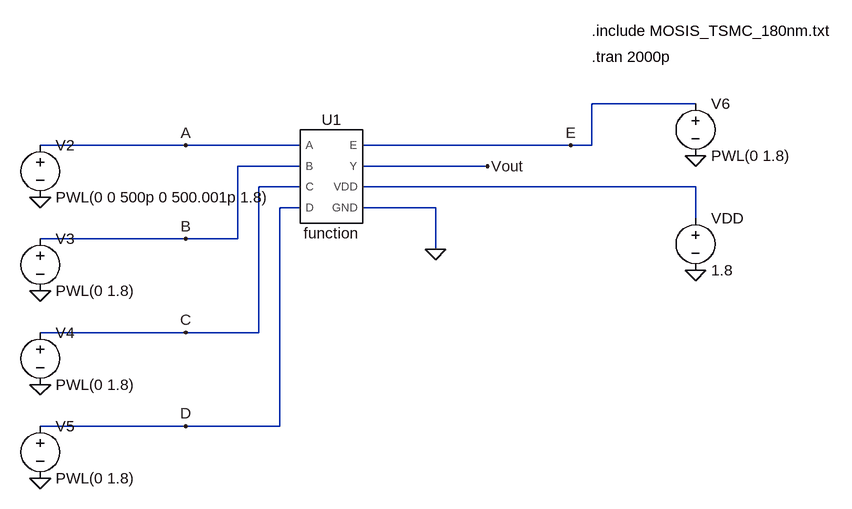
[diagram p0: schematic function.asc]
function.asc, the LTspice schematic file:
Version 4.1
SHEET 1 1000 964
WIRE 768 128 608 128
WIRE -16 192 -240 192
WIRE 160 192 -16 192
WIRE 576 192 256 192
WIRE 608 192 608 128
WIRE 608 192 576 192
WIRE 160 224 64 224
WIRE 448 224 256 224
WIRE 160 256 96 256
WIRE 768 256 256 256
WIRE 160 288 128 288
WIRE 368 288 256 288
WIRE 768 304 768 256
WIRE -16 336 -240 336
WIRE 64 336 64 224
WIRE 64 336 -16 336
WIRE 368 352 368 288
WIRE -16 480 -240 480
WIRE 96 480 96 256
WIRE 96 480 -16 480
WIRE -16 624 -240 624
WIRE 128 624 128 288
WIRE 128 624 -16 624
FLAG -240 560 0
FLAG -240 272 0
FLAG -240 416 0
FLAG 448 224 Vout
FLAG 768 208 0
FLAG 768 384 0
FLAG 368 352 0
FLAG -240 704 0
FLAG -16 192 A
FLAG -16 336 B
FLAG -16 480 C
FLAG -16 624 D
FLAG 576 192 E
SYMBOL voltage -240 176 R0
WINDOW 123 0 0 Left 0
WINDOW 39 0 0 Left 0
SYMATTR InstName V2
SYMATTR Value PWL(0 0 500p 0 500.001p 1.8)
SYMBOL voltage -240 320 R0
WINDOW 123 0 0 Left 0
WINDOW 39 0 0 Left 0
SYMATTR InstName V3
SYMATTR Value PWL(0 1.8)
SYMBOL voltage -240 464 R0
WINDOW 123 0 0 Left 0
WINDOW 39 0 0 Left 0
SYMATTR InstName V4
SYMATTR Value PWL(0 1.8)
SYMBOL function 208 240 R0
SYMATTR InstName U1
SYMBOL voltage 768 288 R0
SYMATTR InstName VDD
SYMATTR Value 1.8
SYMBOL voltage -240 608 R0
WINDOW 123 0 0 Left 0
WINDOW 39 0 0 Left 0
SYMATTR InstName V5
SYMATTR Value PWL(0 1.8)
SYMBOL voltage 768 112 R0
WINDOW 123 0 0 Left 0
WINDOW 39 0 0 Left 0
SYMATTR InstName V6
SYMATTR Value PWL(0 1.8)
TEXT 608 16 Left 2 !.include MOSIS_TSMC_180nm.txt
TEXT 608 56 Left 2 !.tran 2000p

The netlist it stands for:
* function.asc
V2 A 0 PWL(0 0 500p 0 500.001p 1.8)
V3 B 0 PWL(0 1.8)
V4 C 0 PWL(0 1.8)
X§U1 A B C D E Vout N001 0 function  ; pins A B C D E Y VDD GND
VDD N001 0 1.8
V5 D 0 PWL(0 1.8)
V6 E 0 PWL(0 1.8)
.include MOSIS_TSMC_180nm.txt
.tran 2000p
.lib C:\Users\Vishwa\OneDrive\Documents\AU_5th_sem\ECE502_VLSI\Layout\function.spi
.backanno
.end